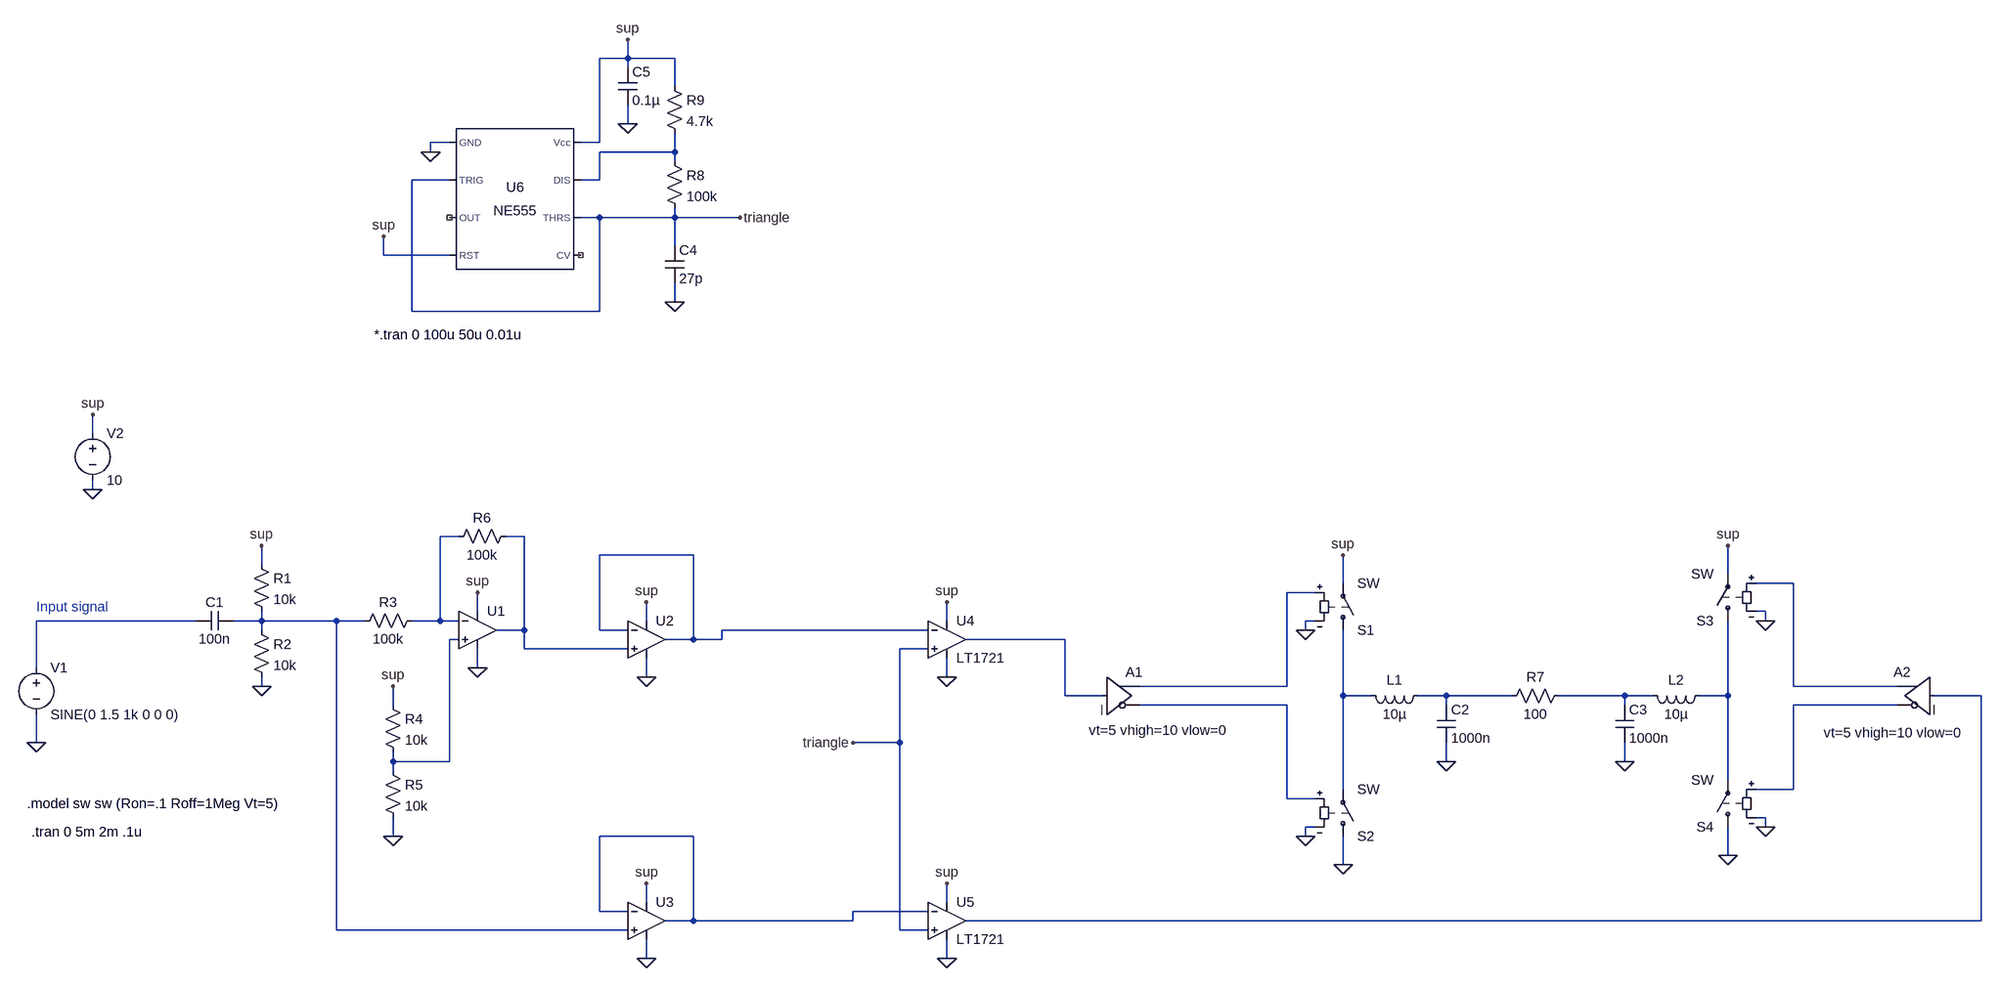
[diagram p0: schematic real_components.asc]
real_components.asc, the LTspice schematic file:
Version 4
SHEET 1 4872 680
WIRE 1200 -912 1200 -944
WIRE 1200 -912 1152 -912
WIRE 1280 -912 1200 -912
WIRE 1200 -896 1200 -912
WIRE 1280 -864 1280 -912
WIRE 1200 -800 1200 -832
WIRE 896 -768 864 -768
WIRE 1152 -768 1152 -912
WIRE 1152 -768 1120 -768
WIRE 864 -752 864 -768
WIRE 1280 -752 1280 -784
WIRE 1280 -752 1152 -752
WIRE 1280 -736 1280 -752
WIRE 896 -704 832 -704
WIRE 1152 -704 1152 -752
WIRE 1152 -704 1120 -704
WIRE 1152 -640 1120 -640
WIRE 1280 -640 1280 -656
WIRE 1280 -640 1152 -640
WIRE 1392 -640 1280 -640
WIRE 1280 -592 1280 -640
WIRE 784 -576 784 -608
WIRE 896 -576 784 -576
WIRE 1280 -496 1280 -528
WIRE 832 -480 832 -704
WIRE 1152 -480 1152 -640
WIRE 1152 -480 832 -480
WIRE 288 -272 288 -304
WIRE 288 -176 288 -192
WIRE 912 -96 880 -96
WIRE 1024 -96 992 -96
WIRE 1312 -64 1152 -64
WIRE 576 -48 576 -80
WIRE 3152 -32 3152 -80
WIRE 2496 -16 2496 -64
WIRE 3264 -16 3200 -16
WIRE 2448 0 2400 0
WIRE 944 32 944 0
WIRE 3216 32 3200 32
WIRE 464 48 192 48
WIRE 576 48 576 32
WIRE 576 48 528 48
WIRE 704 48 576 48
WIRE 752 48 704 48
WIRE 880 48 880 -96
WIRE 880 48 832 48
WIRE 912 48 880 48
WIRE 1232 48 1232 16
WIRE 1744 48 1744 16
WIRE 2448 48 2432 48
WIRE 3216 48 3216 32
WIRE 576 64 576 48
WIRE 1024 64 1024 -96
WIRE 1024 64 976 64
WIRE 1152 64 1152 -64
WIRE 1200 64 1152 64
WIRE 1712 64 1360 64
WIRE 2432 64 2432 48
WIRE 912 80 896 80
WIRE 1312 80 1312 -64
WIRE 1312 80 1264 80
WIRE 1360 80 1360 64
WIRE 1360 80 1312 80
WIRE 2000 80 1776 80
WIRE 1024 96 1024 64
WIRE 1200 96 1024 96
WIRE 1712 96 1664 96
WIRE 192 128 192 48
WIRE 944 128 944 96
WIRE 1232 144 1232 112
WIRE 1744 144 1744 112
WIRE 576 160 576 144
WIRE 2400 160 2400 0
WIRE 2400 160 2128 160
WIRE 3264 160 3264 -16
WIRE 3440 160 3264 160
WIRE 2000 176 2000 80
WIRE 2064 176 2000 176
WIRE 2496 176 2496 64
WIRE 2544 176 2496 176
WIRE 2672 176 2624 176
WIRE 2784 176 2672 176
WIRE 2976 176 2864 176
WIRE 3024 176 2976 176
WIRE 3152 176 3152 48
WIRE 3152 176 3104 176
WIRE 3584 176 3504 176
WIRE 800 192 800 160
WIRE 2400 192 2128 192
WIRE 2672 192 2672 176
WIRE 2976 192 2976 176
WIRE 3440 192 3264 192
WIRE 192 256 192 208
WIRE 1664 256 1664 96
WIRE 1664 256 1584 256
WIRE 800 288 800 272
WIRE 896 288 896 80
WIRE 896 288 800 288
WIRE 2672 288 2672 256
WIRE 2976 288 2976 256
WIRE 800 304 800 288
WIRE 3152 320 3152 176
WIRE 2496 336 2496 176
WIRE 3264 336 3264 192
WIRE 3264 336 3200 336
WIRE 2400 352 2400 192
WIRE 2448 352 2400 352
WIRE 3216 384 3200 384
WIRE 2448 400 2432 400
WIRE 3216 400 3216 384
WIRE 800 416 800 384
WIRE 1312 416 1152 416
WIRE 2432 416 2432 400
WIRE 3152 448 3152 400
WIRE 2496 464 2496 416
WIRE 1232 528 1232 496
WIRE 1744 528 1744 496
WIRE 1152 544 1152 416
WIRE 1200 544 1152 544
WIRE 1712 544 1584 544
WIRE 1312 560 1312 416
WIRE 1312 560 1264 560
WIRE 1584 560 1584 544
WIRE 1584 560 1312 560
WIRE 3584 560 3584 176
WIRE 3584 560 1776 560
WIRE 704 576 704 48
WIRE 1200 576 704 576
WIRE 1664 576 1664 256
WIRE 1712 576 1664 576
WIRE 1232 624 1232 592
WIRE 1744 624 1744 592
FLAG 192 256 0
FLAG 576 160 0
FLAG 576 -80 sup
FLAG 288 -176 0
FLAG 288 -304 sup
FLAG 944 0 sup
FLAG 944 128 0
FLAG 800 416 0
FLAG 800 160 sup
FLAG 1232 144 0
FLAG 1232 624 0
FLAG 1232 16 sup
FLAG 1232 496 sup
FLAG 1744 144 0
FLAG 1744 624 0
FLAG 1744 16 sup
FLAG 1744 496 sup
FLAG 2432 64 0
FLAG 2432 416 0
FLAG 3216 48 0
FLAG 3216 400 0
FLAG 2496 464 0
FLAG 3152 448 0
FLAG 2496 -64 sup
FLAG 3152 -80 sup
FLAG 2672 288 0
FLAG 2976 288 0
FLAG 1280 -496 0
FLAG 864 -752 0
FLAG 1200 -800 0
FLAG 1200 -944 sup
FLAG 784 -608 sup
FLAG 1392 -640 triangle
FLAG 1584 256 triangle
SYMBOL voltage 192 112 R0
WINDOW 123 0 0 Left 0
WINDOW 39 0 0 Left 0
SYMATTR InstName V1
SYMATTR Value SINE(0 1.5 1k 0 0 0)
SYMBOL cap 528 32 R90
WINDOW 0 0 32 VBottom 2
WINDOW 3 32 32 VTop 2
SYMATTR InstName C1
SYMATTR Value 100n
SYMBOL res 560 -64 R0
SYMATTR InstName R1
SYMATTR Value 10k
SYMBOL res 560 48 R0
SYMATTR InstName R2
SYMATTR Value 10k
SYMBOL voltage 288 -288 R0
WINDOW 123 0 0 Left 0
WINDOW 39 0 0 Left 0
SYMATTR InstName V2
SYMATTR Value 10
SYMBOL res 848 32 R90
WINDOW 0 0 56 VBottom 2
WINDOW 3 32 56 VTop 2
SYMATTR InstName R3
SYMATTR Value 100k
SYMBOL res 784 176 R0
SYMATTR InstName R4
SYMATTR Value 10k
SYMBOL res 784 288 R0
SYMATTR InstName R5
SYMATTR Value 10k
SYMBOL res 1008 -112 R90
WINDOW 0 0 56 VBottom 2
WINDOW 3 32 56 VTop 2
SYMATTR InstName R6
SYMATTR Value 100k
SYMBOL OpAmps\\UniversalOpAmp 944 64 R0
SYMATTR InstName U1
SYMBOL OpAmps\\UniversalOpAmp 1232 80 R0
SYMATTR InstName U2
SYMBOL OpAmps\\UniversalOpAmp 1232 560 R0
SYMATTR InstName U3
SYMBOL Comparators\\LT1721 1744 16 R0
SYMATTR InstName U4
SYMBOL Comparators\\LT1721 1744 496 R0
SYMATTR InstName U5
SYMBOL Digital\\buf 2064 112 R0
WINDOW 123 -23 123 Left 2
SYMATTR Value2 vt=5 vhigh=10 vlow=0
SYMATTR InstName A1
SYMBOL Digital\\buf 3504 112 M0
WINDOW 123 -46 127 Left 2
SYMATTR Value2 vt=5 vhigh=10 vlow=0
SYMATTR InstName A2
SYMBOL sw 2496 80 M180
SYMATTR InstName S1
SYMBOL sw 2496 432 M180
SYMATTR InstName S2
SYMBOL sw 3152 64 R180
SYMATTR InstName S3
SYMBOL sw 3152 416 R180
SYMATTR InstName S4
SYMBOL ind 2640 160 R90
WINDOW 0 5 56 VBottom 2
WINDOW 3 32 56 VTop 2
SYMATTR InstName L1
SYMATTR Value 10µ
SYMBOL ind 3120 160 R90
WINDOW 0 5 56 VBottom 2
WINDOW 3 32 56 VTop 2
SYMATTR InstName L2
SYMATTR Value 10µ
SYMBOL res 2880 160 R90
WINDOW 0 0 56 VBottom 2
WINDOW 3 32 56 VTop 2
SYMATTR InstName R7
SYMATTR Value 100
SYMBOL cap 2656 192 R0
SYMATTR InstName C2
SYMATTR Value 1000n
SYMBOL cap 2960 192 R0
SYMATTR InstName C3
SYMATTR Value 1000n
SYMBOL Misc\\NE555 1008 -672 R0
SYMATTR InstName U6
SYMBOL cap 1264 -592 R0
SYMATTR InstName C4
SYMATTR Value 27p
SYMATTR SpiceLine V=50 Irms=0 Rser=0 Lser=0 mfg="Murata" pn="GRM0335C1H270JA01" type="C0G"
SYMBOL res 1264 -752 R0
SYMATTR InstName R8
SYMATTR Value 100k
SYMATTR SpiceLine tol=0.1 pwr=100m
SYMBOL res 1264 -880 R0
SYMATTR InstName R9
SYMATTR Value 4.7k
SYMATTR SpiceLine tol=0.1 pwr=100m
SYMBOL cap 1184 -896 R0
SYMATTR InstName C5
SYMATTR Value 0.1µ
TEXT 192 24 Left 2 ;Input signal
TEXT 184 408 Left 2 !.tran 0 5m 2m .1u
TEXT 176 360 Left 2 !.model sw sw (Ron=.1 Roff=1Meg Vt=5)
TEXT 768 -440 Left 2 !*.tran 0 100u 50u 0.01u

The netlist it stands for:
* real_components.asc
V1 N007 0 SINE(0 1.5 1k 0 0 0)
C1 N008 N007 100n
R1 sup N008 10k
R2 N008 0 10k
V2 sup 0 10
R3 N002 N008 100k
R4 sup N009 10k
R5 N009 0 10k
R6 N003 N002 100k
XU1 N009 N002 sup 0 N003 level1 Avol=1Meg GBW=10Meg Vos=0 En=0 Enk=0 In=0 Ink=0 Rin=500Meg  ; pins In+ In- V+ V- OUT
XU2 N003 N004 sup 0 N004 level1 Avol=1Meg GBW=10Meg Vos=0 En=0 Enk=0 In=0 Ink=0 Rin=500Meg  ; pins In+ In- V+ V- OUT
XU3 N008 N018 sup 0 N018 level1 Avol=1Meg GBW=10Meg Vos=0 En=0 Enk=0 In=0 Ink=0 Rin=500Meg  ; pins In+ In- V+ V- OUT
XU4 triangle N004 sup 0 N010 LT1720  ; LT1721, pins In+ In- V+ V- OUT
XU5 triangle N018 sup 0 N015 LT1720  ; LT1721, pins In+ In- V+ V- OUT
A1 N010 0 0 0 0 N016 N006 0 BUF vt=5 vhigh=10 vlow=0
A2 N015 0 0 0 0 N017 N005 0 BUF vt=5 vhigh=10 vlow=0
S1 N011 sup N006 0 SW
S2 0 N011 N016 0 SW
S3 N014 sup N005 0 SW
S4 0 N014 N017 0 SW
L1 N012 N011 10µ
L2 N014 N013 10µ
R7 N013 N012 100
C2 N012 0 1000n
C3 N013 0 1000n
XU6 0 triangle NC_01 sup NC_02 triangle N001 sup NE555  ; pins GND TRIG OUT RST CV THRS DIS Vcc
C4 triangle 0 27p V=50 Irms=0 Rser=0 Lser=0 mfg="Murata" pn="GRM0335C1H270JA01" type="C0G"
R8 N001 triangle 100k tol=0.1 pwr=100m
R9 sup N001 4.7k tol=0.1 pwr=100m
C5 sup 0 0.1µ
* Input signal
.tran 0 5m 2m .1u
.model sw sw (Ron=.1 Roff=1Meg Vt=5)
*.tran 0 100u 50u 0.01u
.lib UniversalOpAmp1.lib
.lib LTC.lib
.lib NE555.sub
.backanno
.end